# Altium project RN-52_kit.PrjPcb
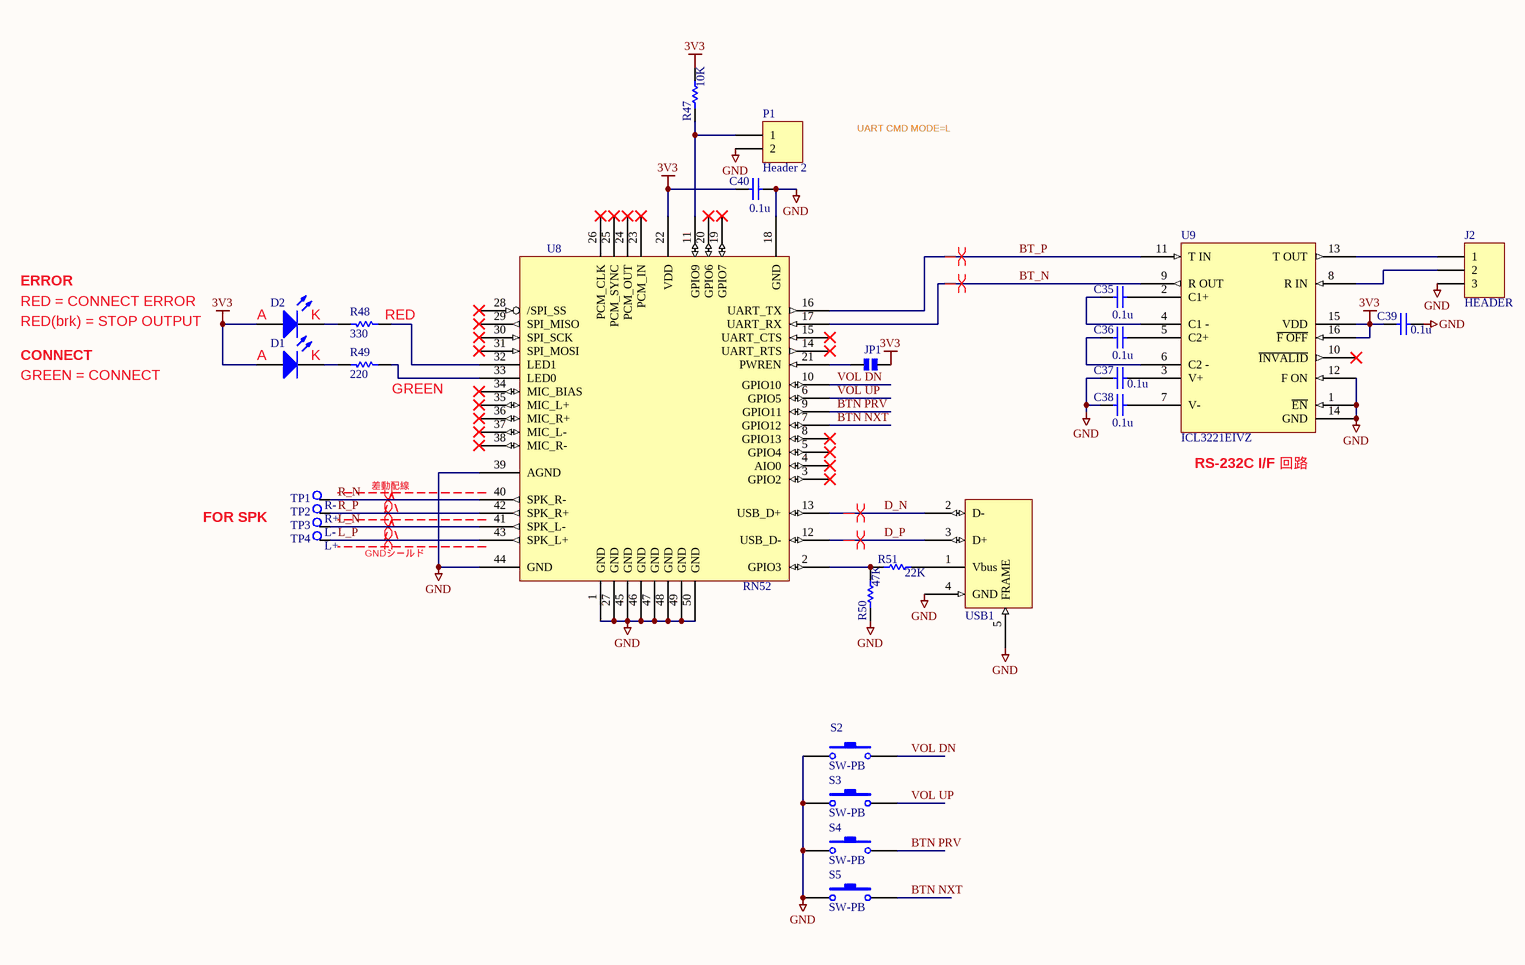
[diagram p0: Sheet1.SchDoc]
1 sheet, 27 parts. Net scope: global (net labels, ports and power ports of the same name join across sheets).
Board file: PCB.PcbDoc

## Sheet Sheet1.SchDoc
size A3; CompanyName: 瀬沼電子; Organization: 瀬沼電子; Address1: 〒197-0827; Address2: 東京都あきる野; Address3: 油平259; Phone: 042-558-0141; Rule: PcbType=ProtelPcb

### Parts
C35  0.1u  [1608[0603]]
C36  0.1u  [1608[0603]]
C37  0.1u  [1608[0603]]
C38  0.1u  [1608[0603]]
C39  0.1u  [1608[0603]]
C40  0.1u  [1608[0603]]
D1  LED2  [LED_2012_DIOC2012X08N]  (value not drawn)
D2  LED2  [LED_2012_DIOC2012X08N]  (value not drawn)
J2  HEADER  [3x 2.5mm pitch Pad]
JP1  JP4  [JUMP_PAD]  (value not drawn)
P1  Header 2  [2x 2.5mm pitch Pad]
R47  10K  [1608[0603]]
R48  330  [1608[0603]]
R49  220  [1608[0603]]
R50  47K  [1608[0603]]
R51  22K  [1608[0603]]
S2  SW-PB  [TACT_SW]
S3  SW-PB  [TACT_SW]
S4  SW-PB  [TACT_SW]
S5  SW-PB  [TACT_SW]
TP1  R-  [PAD1]
TP2  R+  [PAD1]
TP3  L-  [PAD1]
TP4  L+  [PAD1]
U8  RN52  [RN-52]
U9  ICL3221EIVZ  [16_TSSOP_TSOP65P640X110-16N]
USB1  USB002  [USB2.5-2H4C]  (value not drawn)

### Nets
3V3: C39.1 C40.1 D1.1(A) D2.1(A) JP1.2 R47.2 U8.22(VDD) U9.15(VDD) U9.16(~{F_OFF})
GND: C37.1 C38.1 C39.2 C40.2 J2.3 P1.2 R50.1 S2.1 S3.1 S4.1 S5.1 U8.1(GND) U8.18(GND) U8.27(GND) U8.39(AGND) U8.44(GND) U8.45(GND) U8.46(GND) U8.47(GND) U8.48(GND) U8.49(GND) U8.50(GND) U9.1(~{EN}) U9.12(F_ON) U9.14(GND) USB1.4(GND) USB1.5(FRAME)
BT_N: U8.17(UART_RX) U9.9(R_OUT)
BT_P: U8.16(UART_TX) U9.11(T_IN)
BTN NXT: S5.2 U8.7(GPIO12)
BTN PRV: S4.2 U8.9(GPIO11)
D_N: U8.13(USB_D+) USB1.2(D-)
D_P: U8.12(USB_D-) USB1.3(D+)
L_N: TP3.1 U8.41(SPK_L-)
L_P: TP4.1 U8.43(SPK_L+)
R_N: TP1.1 U8.40(SPK_R-)
R_P: TP2.1 U8.42(SPK_R+)
VOL DN: S2.2 U8.10(GPIO10)
VOL UP: S3.2 U8.6(GPIO5)
NetC35_1: C35.1 U9.4(C1_-)
NetC35_2: C35.2 U9.2(C1+)
NetC36_1: C36.1 U9.6(C2_-)
NetC36_2: C36.2 U9.5(C2+)
NetC37_2: C37.2 U9.3(V+)
NetC38_2: C38.2 U9.7(V-)
NetD1_2: D1.2(K) R49.2
NetD2_2: D2.2(K) R48.2
NetJ2_1: J2.1 U9.13(T_OUT)
NetJ2_2: J2.2 U9.8(R_IN)
NetJP1_1: JP1.1 U8.21(PWREN)
NetP1_1: P1.1 R47.1 U8.11(GPIO9)
NetR48_1: R48.1 U8.32(LED1)
NetR49_1: R49.1 U8.33(LED0)
NetR50_2: R50.2 R51.2 U8.2(GPIO3)
NetR51_1: R51.1 USB1.1(Vbus)

Not connected (* = marked no-connect by the designer): U8 3(GPIO2)* 4(AIO0)* 5(GPIO4)* 8(GPIO13)* 14(UART_RTS)* 15(UART_CTS)* 19(GPIO7)* 20(GPIO6)* 23(PCM_IN)* 24(PCM_OUT)* 25(PCM_SYNC)* 26(PCM_CLK)* 28(/SPI_SS)* 29(SPI_MISO)* 30(SPI_SCK)* 31(SPI_MOSI)* 34(MIC_BIAS)* 35(MIC_L+)* 36(MIC_R+)* 37(MIC_L-)* 38(MIC_R-)*; U9 10(~{INVALID})*

### Layout directives
differential pair: BT_N, BT_P, D_N, D_P, L_N, L_P, R_N, R_P

### Notes on the sheet
- UART CMD MODE=L
- RED = CONNECT ERROR
- ERROR
- (near D2) A
- (near D2) K
- (near R48) RED
- CONNECT
- GREEN = CONNECT
- RED(brk) = STOP OUTPUT
- A
- (near D1) K
- (near R49) GREEN
- 差動配線
- (near U9) RS-232C I/F 回路
- FOR SPK
- GNDシールド
- A3
- Designer:
- Company:
- Title:
- Dept.:
- Email:
- Revisions:
- Notes:
- File:
- Scale:
- rev:
- sheet:
- of
- Marked:

### Library data of the parts
C35-C40 = Cap Semi: Capacitor (Semiconductor SIM Model); Published: 8-Jun-2000; LatestRevisionDate: 29-May-2009; LatestRevisionNote: IPC-7351 Footprint Added.; PackageReference: C1206; Publisher: Altium Limited; PackageDescription: Chip Capacitor; Value: 0.1u
D1 D2 = LED2: Typical RED, GREEN, YELLOW, AMBER GaAs LED; Published: 8-Jun-2000; LatestRevisionDate: 17-Jul-2002; LatestRevisionNote: Re-released for DXP Platform.; PackageVersion: Feb-2002; PackageReference: 3.2X1.6X1.1; Publisher: Altium Limited; PackageDescription: SM LED; 2 Flat Leads
J2 = Header 3: Header, 3-Pin; LatestRevisionDate: 17-Jul-2002; LatestRevisionNote: Re-released for DXP Platform.; Publisher: Altium Limited
P1 = Header 2: Header, 2-Pin; LatestRevisionDate: 17-Jul-2002; LatestRevisionNote: Re-released for DXP Platform.; Publisher: Altium Limited
R47 R50 R51 = Res Semi: Semiconductor Resistor; Published: 8-Jun-2000; LatestRevisionDate: 17-Jul-2002; LatestRevisionNote: Re-released for DXP Platform.; PackageReference: AXIAL-0.5; Publisher: Altium Limited
  R47: Value: 10K
  R50: Value: 47K
  R51: Value: 22K
R48 R49 = Res1: Resistor; PARTS: AH-50W 10R; PRICE: 350; LatestRevisionDate: 17-Jul-2002; LatestRevisionNote: Re-released for DXP Platform.; PackageReference: AXIAL-0.3
  R48: Value: 330
  R49: Value: 220
S2-S5 = SW-PB: Switch; Published: 24-Mar-1999; LatestRevisionDate: 17-Jul-2002; LatestRevisionNote: Re-released for DXP Platform.; PackageReference: SPST-2; Publisher: Altium Limited; PackageDescription: Switch; 2 Leads
TP1-TP4 = RAUND1
U9 = TRS3221E